# Altium schematic sheet Other.SchDoc
size Tabloid; DocumentNumber: 9; SheetNumber: 9; SheetTotal: 11; SheetName: LEDs and I2C exp. connector; Size: 11x17; Sheet_Name: LEDs and I2C exp. connector
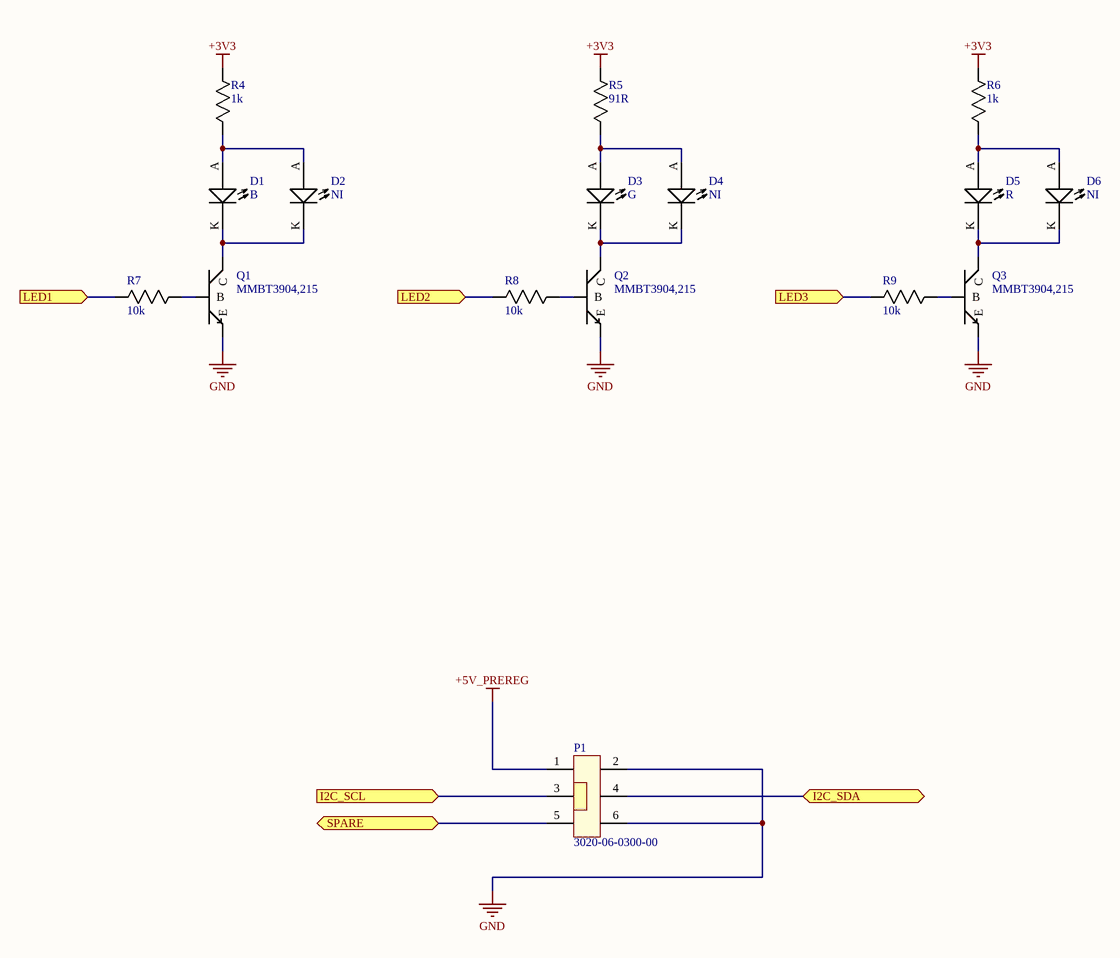
[diagram p0: Other.SchDoc]

## Parts
D1  Type: B  [0805_LED]  (hidden comment: Diode_LED)
D2  Diode_LED  [0805_LED]  (value not drawn)
D3  Type: G  [0805_LED]  (hidden comment: Diode_LED)
D4  Diode_LED  [0805_LED]  (value not drawn)
D5  Type: R  [0805_LED]  (hidden comment: Diode_LED)
D6  Diode_LED  [0805_LED]  (value not drawn)
P1  Mfg_PN: 3020-06-0300-00  [CONN6_100mils_pol_SMD]  (hidden comment: CON6_3020-06-0300-00)
Q1  Mfg_PN: MMBT3904,215  [SOT23_GDS]  (hidden comment: BJT_N_GDS)
Q2  Mfg_PN: MMBT3904,215  [SOT23_GDS]  (hidden comment: BJT_N_GDS)
Q3  Mfg_PN: MMBT3904,215  [SOT23_GDS]  (hidden comment: BJT_N_GDS)
R4  value 1k  [0603]  (hidden comment: Resistor)
R5  value 91R  [0603]  (hidden comment: Resistor)
R6  value 1k  [0603]  (hidden comment: Resistor)
R7  value 10k  [0603]  (hidden comment: Resistor)
R8  value 10k  [0603]  (hidden comment: Resistor)
R9  value 10k  [0603]  (hidden comment: Resistor)

## Ports
I2C_SCL (in), I2C_SDA (bidir), LED1 (in), LED2 (in), LED3 (in), SPARE (bidir)

## Nets
+3V3: R4.2 R5.2 R6.2
+5V_PREREG: P1.1
GND: P1.2 P1.6 Q1.S(E) Q2.S(E) Q3.S(E)
I2C_SCL: P1.3 ; port I2C_SCL
I2C_SDA: P1.4 ; port I2C_SDA
LED1: R7.1 ; port LED1
LED2: R8.1 ; port LED2
LED3: R9.1 ; port LED3
SPARE: P1.5 ; port SPARE
NetD1_A: D1.A D2.A R4.1
NetD1_K: D1.K D2.K Q1.D(C)
NetD3_A: D3.A D4.A R5.1
NetD3_K: D3.K D4.K Q2.D(C)
NetD5_A: D5.A D6.A R6.1
NetD5_K: D5.K D6.K Q3.D(C)
NetQ1_G: Q1.G(B) R7.2
NetQ2_G: Q2.G(B) R8.2
NetQ3_G: Q3.G(B) R9.2

## Notes on the sheet
- Sheet Name
- Project Title
- Size
- Group
- Revision
- Date :
- Filename :
- Sheet
- Authors :
- of

## Library data of the parts
D1 = Diode_LED: LED; Mfg: Wurth; Mfg_PN: 150080BS75000; HelpURL: *; NI: *; Supplier1: Digikey; Supplier1_PN: 732-4982-1-ND; Tolerance: *; Rating: *; Value: *
D2 D4 D6 = Diode_LED: LED; Type: R; HelpURL: *; Mfg: *; Mfg_PN: *; NI: NI; Supplier1: *; Supplier1_PN: *; Tolerance: *; Rating: *; Value: *
D3 = Diode_LED: LED; Mfg: Osram; Mfg_PN: LG R971-KN-1; HelpURL: *; NI: *; Supplier1: Digikey; Supplier1_PN: 475-1410-1-ND; Tolerance: *; Rating: *; Value: *
D5 = Diode_LED: LED; Mfg: Osram; Mfg_PN: LS R976-NR-1; HelpURL: *; NI: *; Supplier1: Digikey; Supplier1_PN: 475-1278-1-ND; Tolerance: *; Rating: *; Value: *
P1 = CON6_3020-06-0300-00: 6-pins; Mfg: Harwin; HelpURL: *; NI: *; Rating: *; Supplier1: Digikey; Supplier1_PN: 3020-06-0300-00-ND; Tolerance: *; Type: *; Value: *
Q1-Q3 = BJT_N_GDS: BJT NPN; Mfg: NXP; HelpURL: *; NI: *; Rating: *; Supplier1: Digikey; Supplier1_PN: 568-4510-1-ND; Tolerance: *; Type: *; Value: *
R4 R6 = Resistor: Mfg: Yageo; Mfg_PN: RC0603JR-071KL; HelpURL: *; NI: *; Supplier1: Digikey; Supplier1_PN: 311-1.0KGRCT-ND; Type: *; Rating: *; Tolerance: *
R5 = Resistor: Mfg: Yageo; Mfg_PN: RC0603JR-0791RL; HelpURL: *; NI: *; Supplier1: Digikey; Supplier1_PN: 311-91GRCT-ND; Type: *; Rating: *; Tolerance: *
R7-R9 = Resistor: Mfg: Yageo; Mfg_PN: RC0603JR-0710KL; HelpURL: *; NI: *; Supplier1: Digikey; Supplier1_PN: 311-10KGRCT-ND; Type: *; Rating: *; Tolerance: *